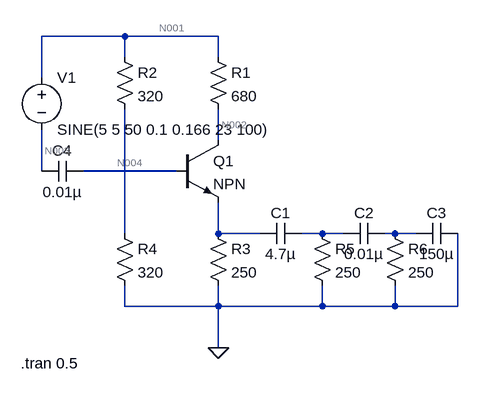
[diagram p0: schematic osc.asc]
osc.asc, the LTspice schematic file:
Version 4.1
SHEET 1 880 708
WIRE 16 -80 -112 -80
WIRE 160 -80 16 -80
WIRE 16 -48 16 -80
WIRE 160 -48 160 -80
WIRE -112 -16 -112 -80
WIRE 160 80 160 32
WIRE -112 128 -112 64
WIRE 96 128 -48 128
WIRE 16 224 16 32
WIRE 160 224 160 176
WIRE 224 224 160 224
WIRE 320 224 288 224
WIRE 352 224 320 224
WIRE 432 224 416 224
WIRE 464 224 432 224
WIRE 16 336 16 304
WIRE 160 336 160 304
WIRE 160 336 16 336
WIRE 320 336 320 304
WIRE 320 336 160 336
WIRE 432 336 432 304
WIRE 432 336 320 336
WIRE 528 336 528 224
WIRE 528 336 432 336
WIRE 160 400 160 336
FLAG 160 400 0
SYMBOL res 144 -64 R0
SYMATTR InstName R1
SYMATTR Value 680
SYMBOL res 0 -64 R0
SYMATTR InstName R2
SYMATTR Value 320
SYMBOL res 144 208 R0
SYMATTR InstName R3
SYMATTR Value 250
SYMBOL res 0 208 R0
SYMATTR InstName R4
SYMATTR Value 320
SYMBOL npn 96 80 R0
SYMATTR InstName Q1
SYMBOL cap 288 208 R90
WINDOW 0 0 32 VBottom 2
WINDOW 3 32 32 VTop 2
SYMATTR InstName C1
SYMATTR Value 4.7µ
SYMATTR SpiceLine V=50 Irms=0 Rser=0 Lser=0 mfg="Murata" pn="GRM31CR71H475KA12" type="X7R"
SYMBOL cap 416 208 R90
WINDOW 0 0 32 VBottom 2
WINDOW 3 32 32 VTop 2
SYMATTR InstName C2
SYMATTR Value 0.01µ
SYMBOL cap 528 208 R90
WINDOW 0 0 32 VBottom 2
WINDOW 3 32 32 VTop 2
SYMATTR InstName C3
SYMATTR Value 150µ
SYMBOL res 304 208 R0
SYMATTR InstName R5
SYMATTR Value 250
SYMBOL res 416 208 R0
SYMATTR InstName R6
SYMATTR Value 250
SYMBOL cap -48 112 R90
WINDOW 0 0 32 VBottom 2
WINDOW 3 32 32 VTop 2
SYMATTR InstName C4
SYMATTR Value 0.01µ
SYMBOL voltage -112 -32 R0
WINDOW 123 0 0 Left 0
WINDOW 39 0 0 Left 0
SYMATTR InstName V1
SYMATTR Value SINE(5 5 50 0.1 0.166 23 100)
TEXT -144 424 Left 2 !.tran 0.5

The netlist it stands for:
* osc.asc
R1 N001 N002 680
R2 N001 N005 320
R3 N006 0 250
R4 N005 0 320
Q1 N002 N004 N006 0 NPN
C1 N007 N006 4.7µ V=50 Irms=0 Rser=0 Lser=0 mfg="Murata" pn="GRM31CR71H475KA12" type="X7R"
C2 N008 N007 0.01µ
C3 0 N008 150µ
R5 N007 0 250
R6 N008 0 250
C4 N004 N003 0.01µ
V1 N001 N003 SINE(5 5 50 0.1 0.166 23 100)
.model NPN NPN
.model PNP PNP
.lib standard.bjt
.tran 0.5
.backanno
.end

* Results of the author's LTspice run, read from the files saved beside the schematic
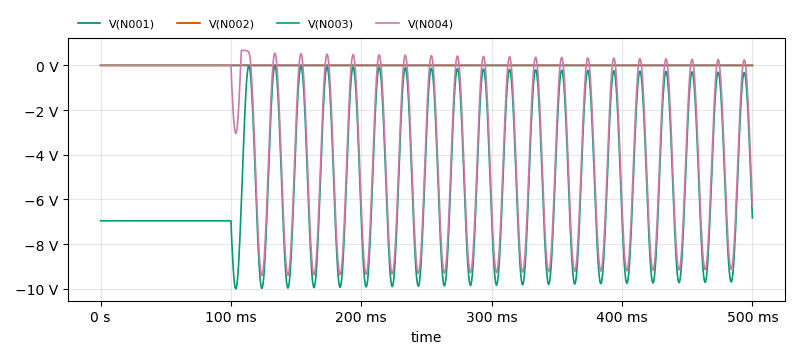
[diagram p1: Transient Analysis of osc.asc, plotted from the saved traces]
* Transient Analysis, 1 run:
*   V(N001): min -2.348 mV, max 6.011 nV, average -16.54 µV, rms 176.9 µV, last 4.009 nV
*   V(N002): min -1.079 nV, max 5.834 mV, average 52.78 µV, rms 510.8 µV, last 0 V
*   V(N003): min -9.996 V, max -15.81 mV, average -5.393 V, rms 6.25 V, last -6.828 V
*   V(N004): min -9.392 V, max 672.3 mV, average -3.419 V, rms 4.901 V, last -6.264 V